# EAGLE design Esquema (EAGLE 9.6.2)
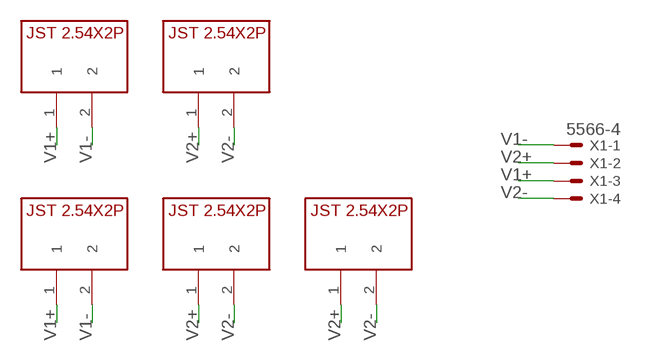
[diagram p0: schematic, sheet 1]

## Parts
U$1  JST2.54X2P  [JST2.54X2P_FOOTPRINT]
U$2  JST2.54X2P  [JST2.54X2P_FOOTPRINT]
U$3  JST2.54X2P  [JST2.54X2P_FOOTPRINT]
U$4  JST2.54X2P  [JST2.54X2P_FOOTPRINT]
U$5  JST2.54X2P  [JST2.54X2P_FOOTPRINT]
X1  5566-4  [5566-4]

## Nets
V1+: U$1.1 U$4.1 X1.3
V1-: U$1.2 U$4.2 X1.1
V2+: U$2.1 U$3.1 U$5.1 X1.2
V2-: U$2.2 U$3.2 U$5.2 X1.4

## Library data of the parts
U$1-U$5 = CRD:JST2.54X2P: Conector JST 2 pinos (2.54mm de distância entre pinos)
X1 = con-molex:5566-4: Mini FIT connector 4 pol Source: http://www.molex.com; MF: MOLEX; OC_FARNELL: unknown; OC_NEWARK: unknown

## Board
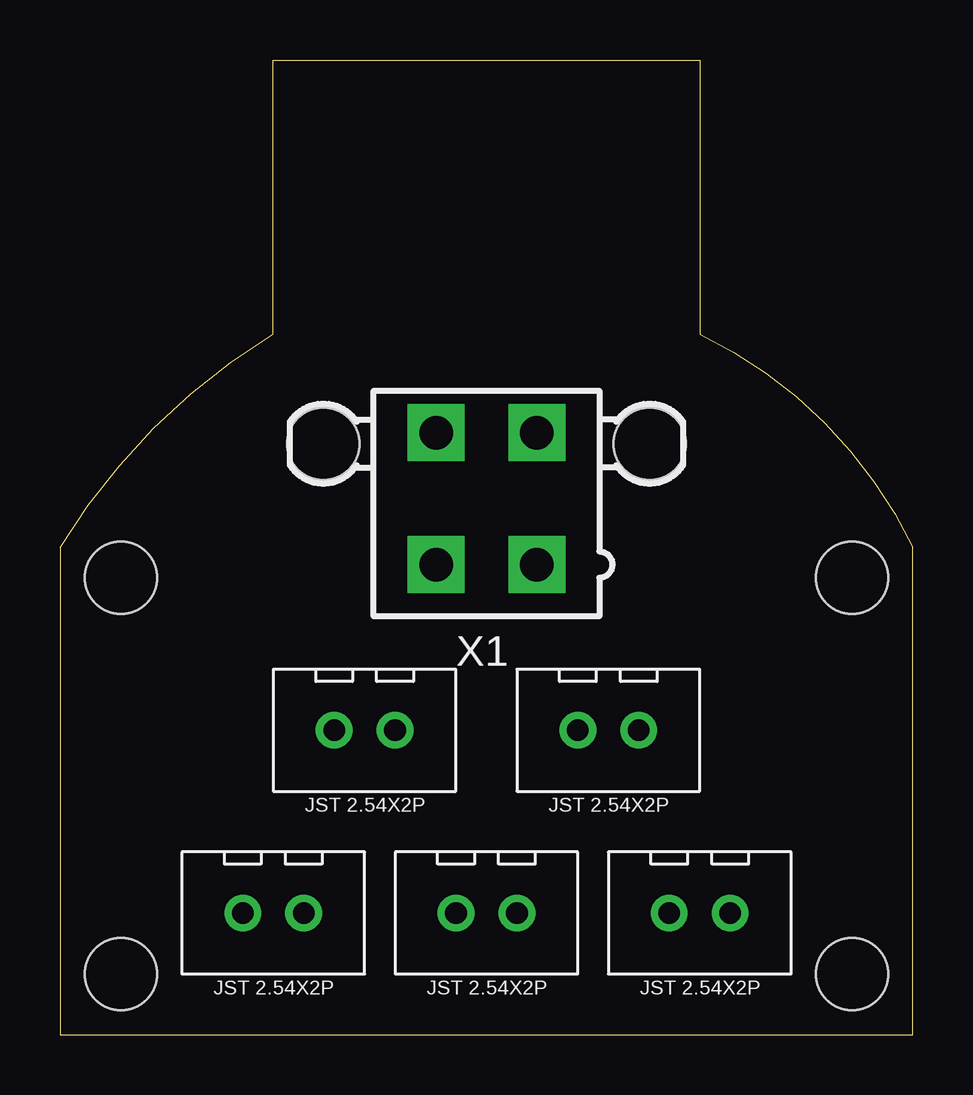
[diagram p1: board, top side]
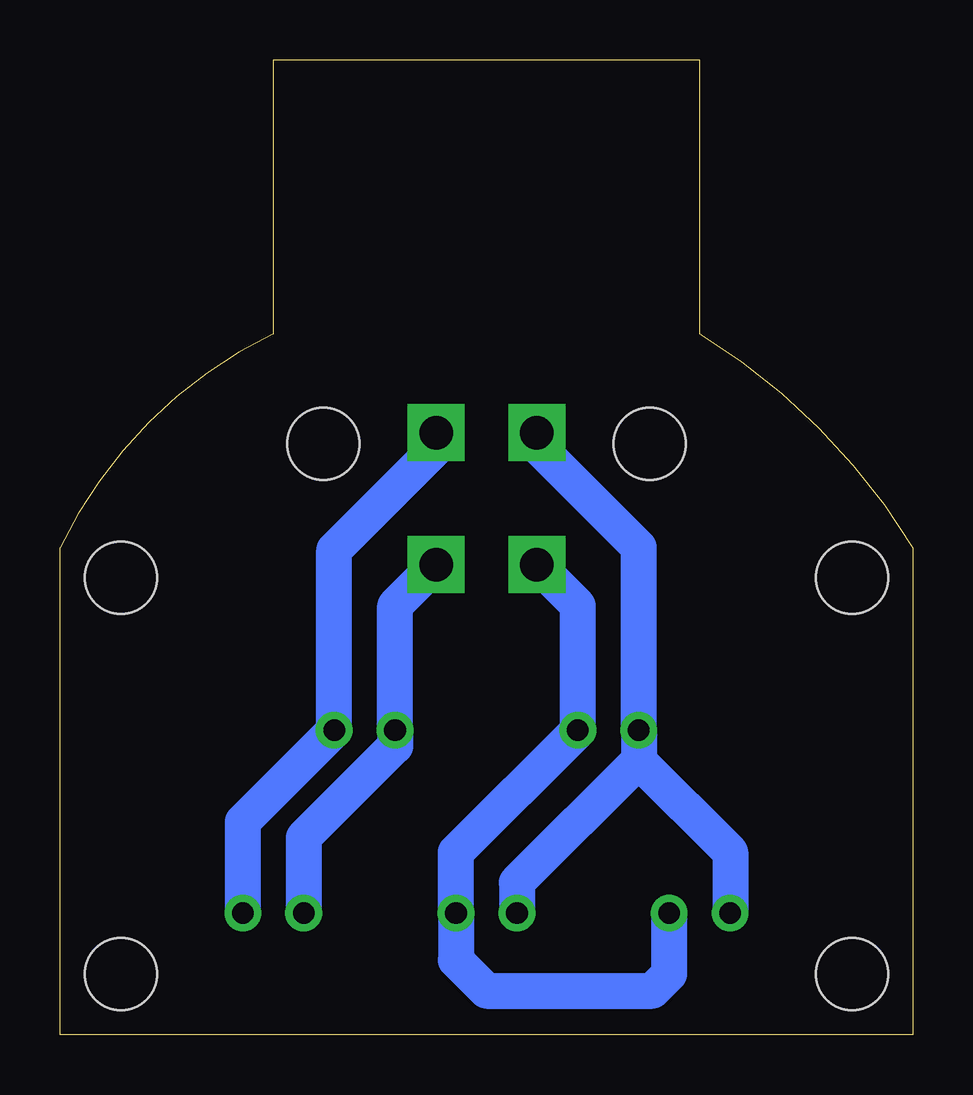
[diagram p2: board, bottom side, seen from below]

Size 35.56 x 40.64 mm. Coordinates in mm from the lower left corner, seen from the top.
Outline: 35.56,0 35.56,20.32 arc39 26.67,29.21 26.67,40.64 8.89,40.64 8.89,29.21 arc27 0,20.32 0,0 35.56,0
Copper layers (1*16): Top 0.035mm / dielectric 1.5mm / Bottom 0.035mm
Design rules "default": minimum track width 1.5mm, minimum drill 1mm, track to track 30mil, track to pad 20mil, pad to pad 6mil, via to via 6mil, smd to smd 6mil, copper to edge 40mil, drill to drill 6mil, minimum pad ring 10mil, minimum via ring 8mil, stop-mask expansion 4mil, vias tented up to drill 0mil, thermal gap 10mil
Holes 3 mm at 33.02,19.05 33.02,2.54 2.54,2.54 2.54,19.05

### Footprints (pad centres in the part's own frame; a part is rotated, then mirrored left to right if it is on the bottom)
JST2.54X2P_FOOTPRINT = drill 0.9: 1 -1.27,0; 2 1.27,0
5566-4 = drill 1.4 square: 1 2.1,-2.75; 2 -2.1,-2.75; 3 2.1,2.75; 4 -2.1,2.75 | hole 3: 6.8,2.29; -6.8,2.29

### Placement (x,y rotation side)
U$1  26.67,5.08 180 top
U$2  17.78,5.08 180 top
U$3  8.89,5.08 180 top
U$4  22.86,12.7 180 top
U$5  12.7,12.7 180 top
X1  17.78,22.35 0 top

### Tracks (layer width: path | path; a pad name or v marks a point on that pad's centre or on a via)
V1+
  Bottom 1.5: U$1.1 27.94,8.89 U$4.1 24.13,20.22 19.88,24.47 X1.3
V1-
  Bottom 1.5: U$1.2 25.4,8.23 21.59,12.04 U$4.2 21.59,17.89 X1.1
V2+
  Bottom 1.5: U$3.1 10.16,2.54 10.86,1.84 17.78,1.84 19.05,3.11 U$2.1 19.05,7.62 U$5.1 13.97,17.89 X1.2
V2-
  Bottom 1.5: U$2.2 16.51,6.35 11.43,11.43 | 11.43,11.43 U$5.2 11.43,20.32 15.68,24.57 X1.4 | 11.43,11.43 7.62,7.62 U$3.2